# EAGLE design i-oboard 2 (EAGLE 9.6.2)
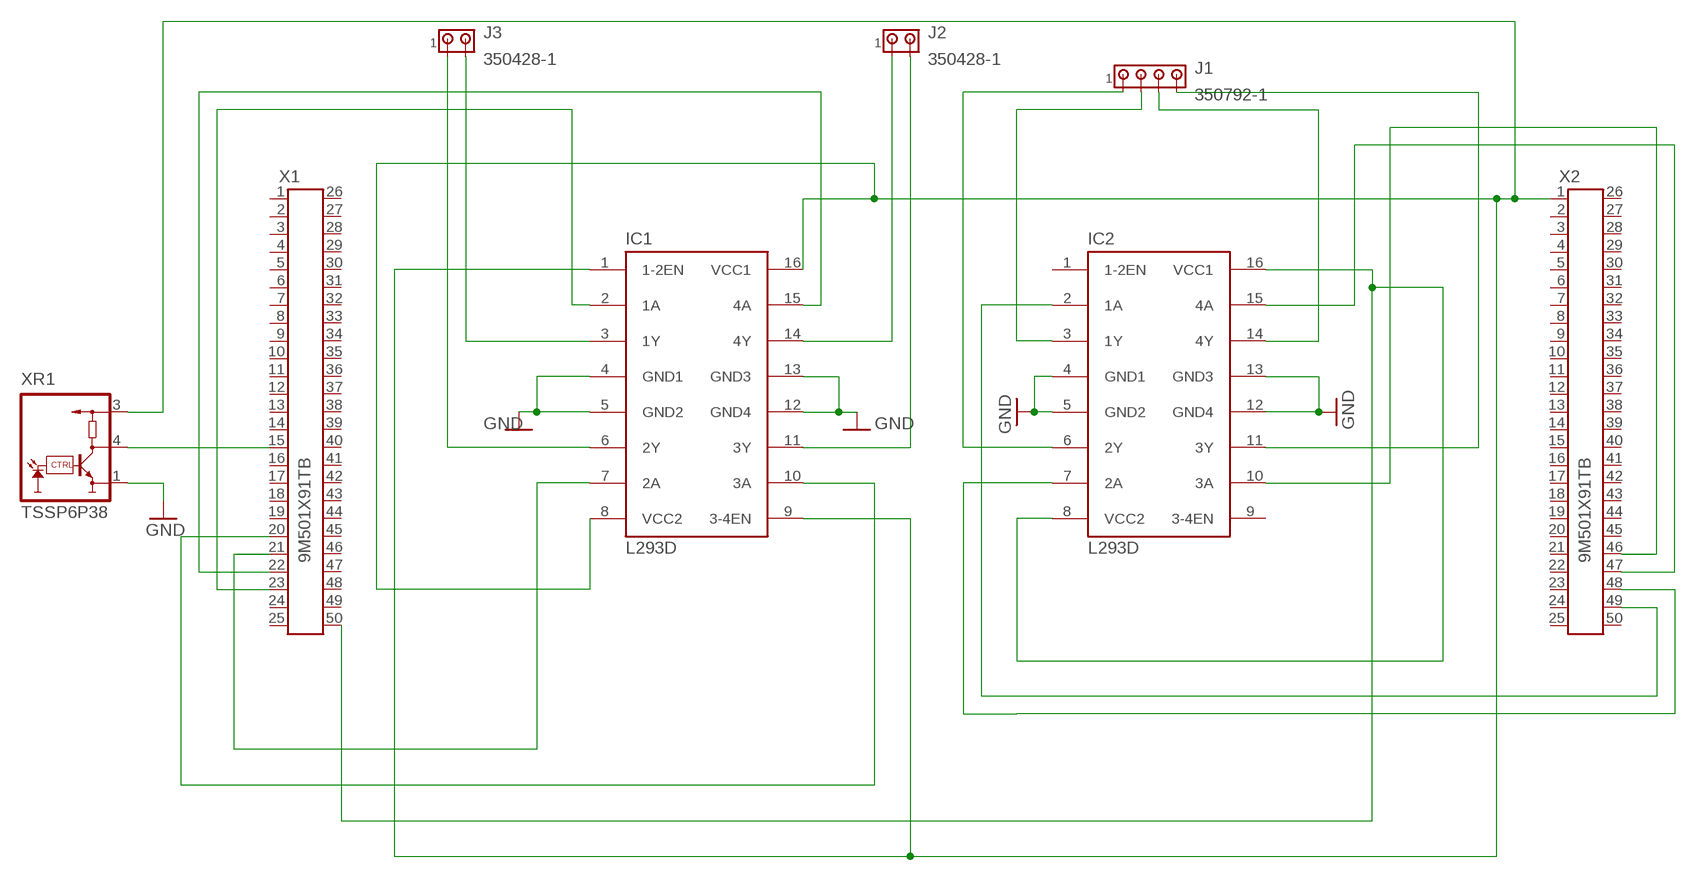
[diagram p0: schematic, sheet 1]

## Parts
IC1  L293D  [DIL16]
IC2  L293D  [DIL16]
J1  350792-1  [350792-1]
J2  350428-1  [350428-1]
J3  350428-1  [350428-1]
X1  9M501X91TB  [9M501X91]
X2  9M501X91TB  [9M501X91]
XR1  TSSP6P38  [TSSP6P38]

## Nets
GND: IC1.4(GND1) IC1.5(GND2) IC1.12(GND4) IC1.13(GND3) IC2.4(GND1) IC2.5(GND2) IC2.12(GND4) IC2.13(GND3) XR1.1(GND)
N$1: IC1.14(4Y) J2.1
N$2: IC1.11(3Y) J2.2
N$3: IC1.3(1Y) J3.2
N$4: IC1.6(2Y) J3.1
N$6: IC2.10(3A) X2.46
N$7: IC2.7(2A) X2.48
N$8: IC2.2(1A) X2.49
N$9: IC2.15(4A) X2.47
N$10: IC2.8(VCC2) IC2.16(VCC1) X1.50
N$12: X1.15 XR1.4(OUT)
N$13: IC2.3(1Y) J1.2
N$14: IC2.6(2Y) J1.1
N$15: IC2.14(4Y) J1.3
N$16: IC2.11(3Y) J1.4
N$17: IC1.2(1A) X1.23
N$18: IC1.15(4A) X1.22
N$19: IC1.7(2A) X1.21
N$20: IC1.10(3A) X1.20
N$21: IC1.1(1-2EN) IC1.8(VCC2) IC1.9(3-4EN) IC1.16(VCC1) X2.1 XR1.3(VS)
Unconnected: IC2.1(1-2EN) IC2.9(3-4EN) X1.1 X1.2 X1.3 X1.4 X1.5 X1.6 X1.7 X1.8 X1.9 X1.10 X1.11 X1.12 X1.13 X1.14 X1.16 X1.17 X1.18 X1.19 X1.24 X1.25 X1.26 X1.27 X1.28 X1.29 X1.30 X1.31 X1.32 X1.33 X1.34 X1.35 X1.36 X1.37 X1.38 X1.39 X1.40 X1.41 X1.42 X1.43 X1.44 X1.45 X1.46 X1.47 X1.48 X1.49 X2.2 X2.3 X2.4 X2.5 X2.6 X2.7 X2.8 X2.9 X2.10 X2.11 X2.12 X2.13 X2.14 X2.15 X2.16 X2.17 X2.18 X2.19 X2.20 X2.21 X2.22 X2.23 X2.24 X2.25 X2.26 X2.27 X2.28 X2.29 X2.30 X2.31 X2.32 X2.33 X2.34 X2.35 X2.36 X2.37 X2.38 X2.39 X2.40 X2.41 X2.42 X2.43 X2.44 X2.45 X2.50

## Library data of the parts
IC1 IC2 = st-microelectronics:L293D: PUSH-PULL 4 CHANNEL DRIVER; MPN: L293D; OC_FARNELL: 9589619; OC_NEWARK: 56P8249
J1 = con-amp:350792-1: Universal MATE-N-LOK .250" Centerline, 600 V, 19 - 36 A max Source: http://catalog.tycoelectronics.com/ .. ENG_CD_350792_R.pdf
J2 J3 = con-amp:350428-1: Universal MATE-N-LOK .250" Centerline, 600 V, 19 - 36 A max Source: http://catalog.tycoelectronics.com/ .. ENG_CD_350428_Y.pdf
X1 X2 = con-3m:9M501X91TB: CONNECTOR PCMCIA-CompactFlash; OC_FARNELL: unknown; OC_NEWARK: unknown
XR1 = opto-vishay:TSSP6P38: IR Mid Range Proximity Sensor Used source: IR Sensor transmitter and receiver diode.pdf Source to corrupt Data sheet <http://www.vishay.com/docs/82475/tssp6p38.pdf>

## Board
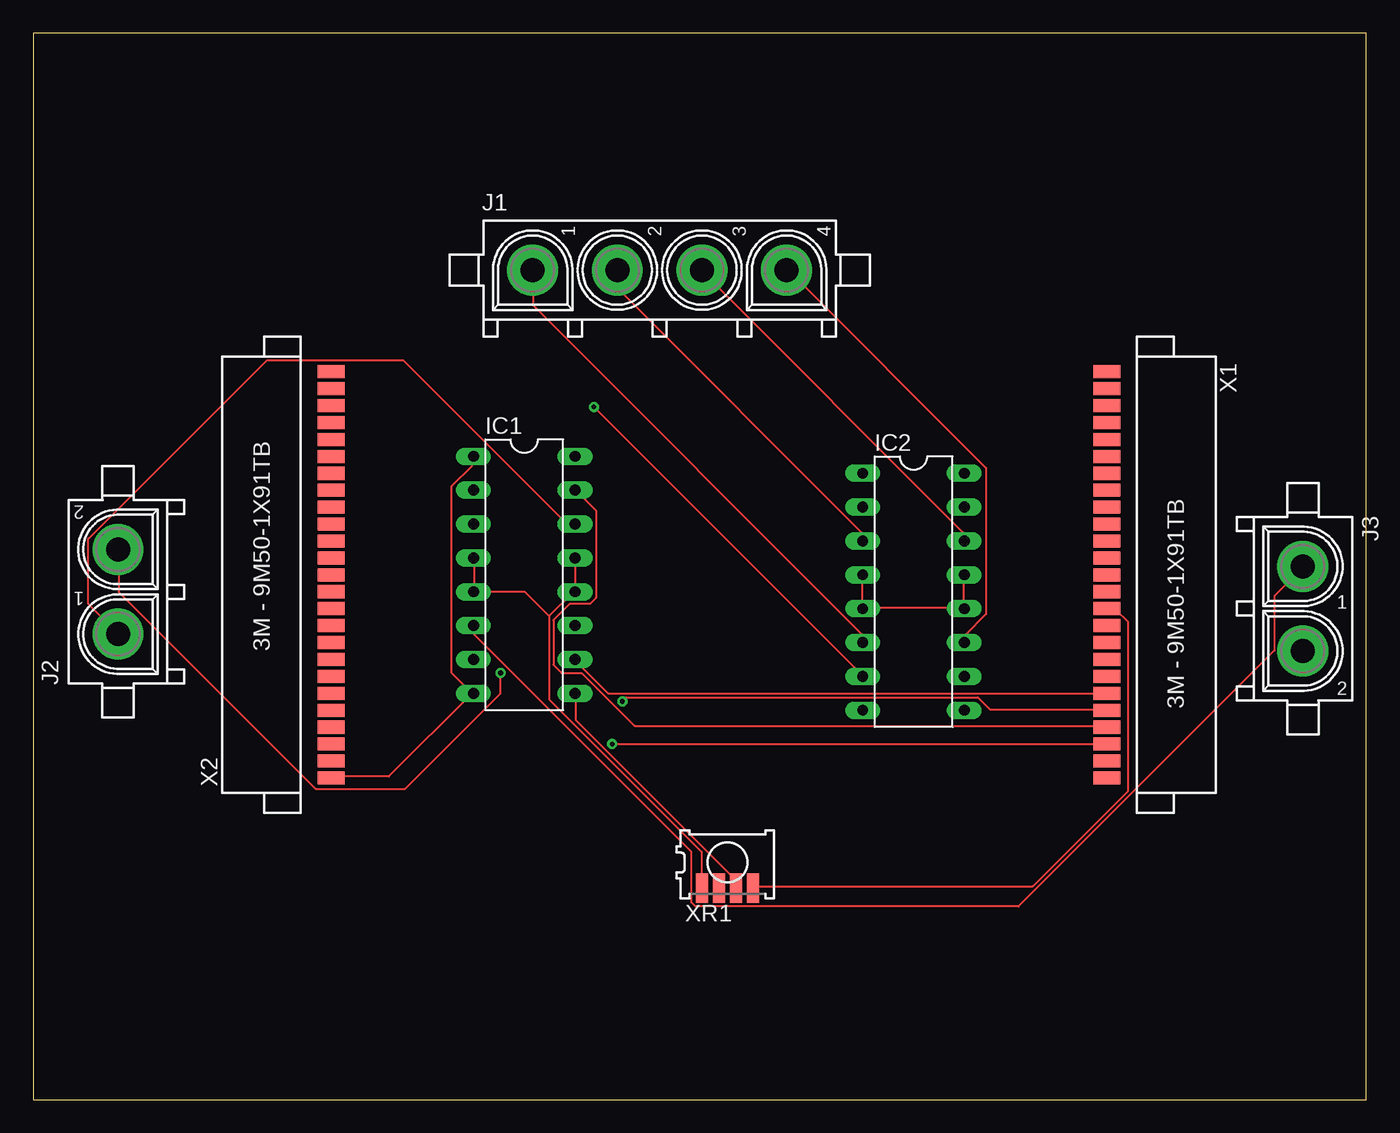
[diagram p1: board, top side]
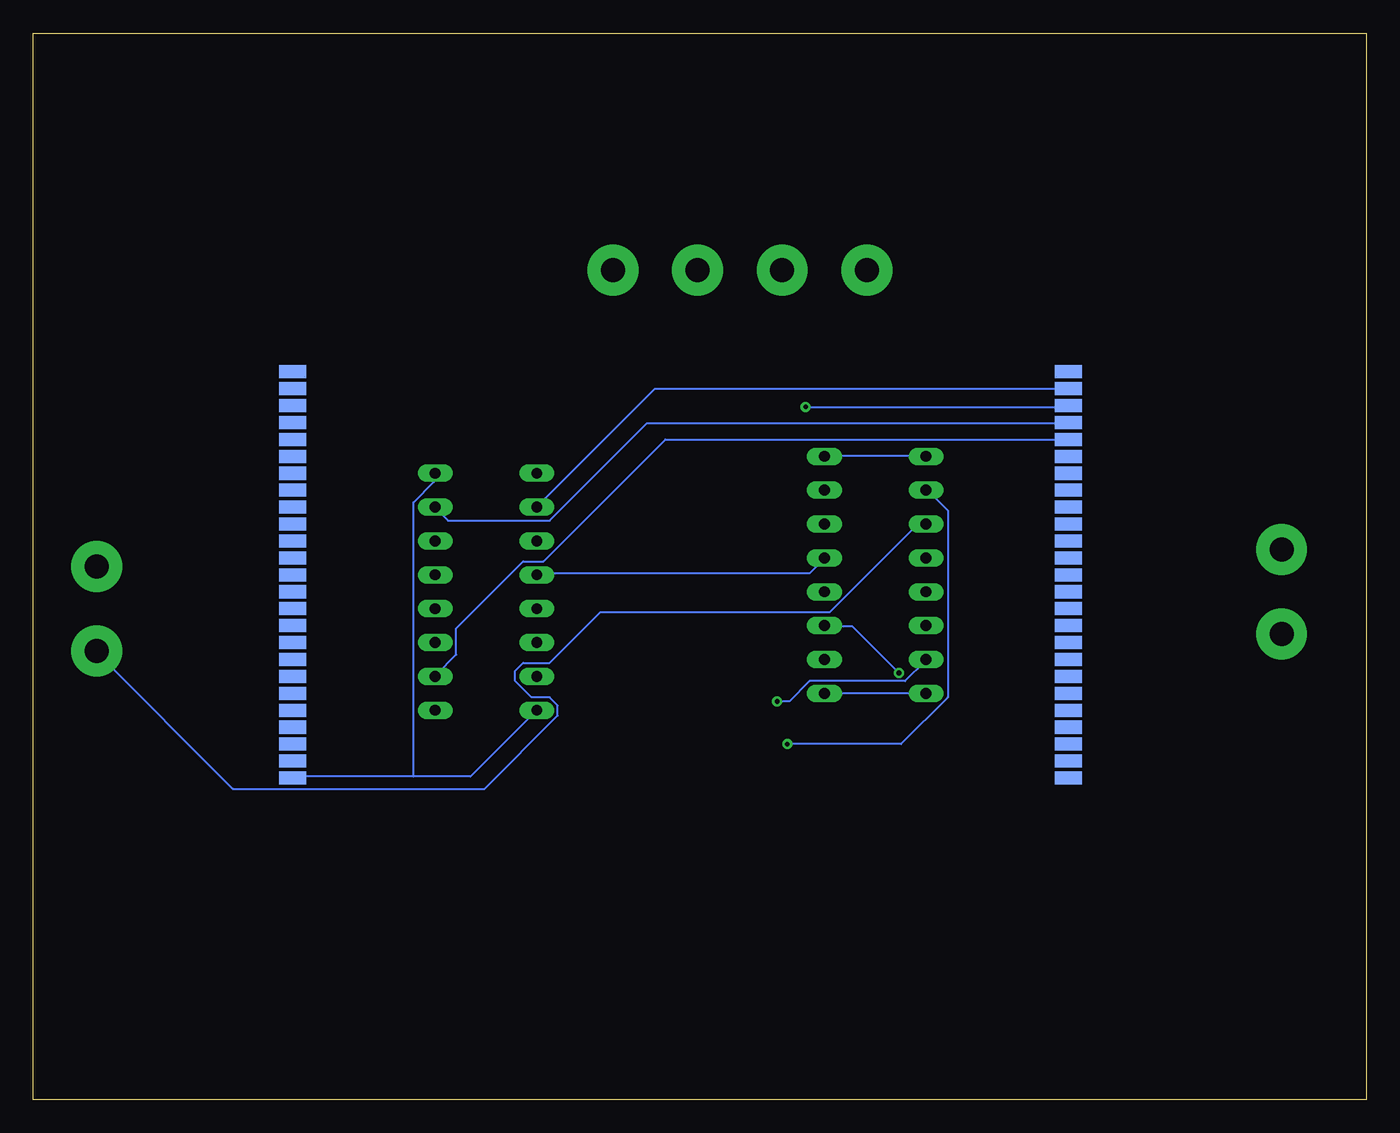
[diagram p2: board, bottom side, seen from below]

Size 100 x 80 mm. Coordinates in mm from the lower left corner, seen from the top.
Outline: 0,0 100,0 100,80 0,80 0,0
Copper layers (1*16): Top 0.035mm / dielectric 1.5mm / Bottom 0.035mm
Design rules "default": minimum track width 6mil, minimum drill 0.35mm, track to track 6mil, track to pad 6mil, pad to pad 6mil, via to via 6mil, smd to smd 6mil, copper to edge 40mil, drill to drill 6mil, minimum pad ring 10mil, minimum via ring 8mil, stop-mask expansion 4mil, vias tented up to drill 0mil, thermal gap 10mil

### Footprints (pad centres in the part's own frame; a part is rotated, then mirrored left to right if it is on the bottom)
DIL16 = drill 0.813 long: 1 -8.89,-3.81; 2 -6.35,-3.81; 3 -3.81,-3.81; 4 -1.27,-3.81; 5 1.27,-3.81; 6 3.81,-3.81; 7 6.35,-3.81; 8 8.89,-3.81; 9 8.89,3.81; 10 6.35,3.81; 11 3.81,3.81; 12 1.27,3.81; 13 -1.27,3.81; 14 -3.81,3.81; 15 -6.35,3.81; 16 -8.89,3.81
350792-1 = drill 1.8 pad 3.81: 1 -9.525,0; 2 -3.175,0; 3 3.175,0; 4 9.525,0
350428-1 = drill 1.8 pad 3.81: 1 -3.175,0; 2 3.175,0
9M501X91 = smd 0.98 x 2.03: 1 -15.24,-3.29; 2 -13.97,-3.29; 3 -12.7,-3.29; 4 -11.43,-3.29; 5 -10.16,-3.29; 6 -8.89,-3.29; 7 -7.62,-3.29; 8 -6.35,-3.29; 9 -5.08,-3.29; 10 -3.81,-3.29; 11 -2.54,-3.29; 12 -1.27,-3.29; 13 0,-3.29; 14 1.27,-3.29; 15 2.54,-3.29; 16 3.81,-3.29; 17 5.08,-3.29; 18 6.35,-3.29; 19 7.62,-3.29; 20 8.89,-3.29; 21 10.16,-3.29; 22 11.43,-3.29; 23 12.7,-3.29; 24 13.97,-3.29; 25 15.24,-3.29 | smd 0.98 x 2.03 bottom: 26 -15.24,-3.29; 27 -13.97,-3.29; 28 -12.7,-3.29; 29 -11.43,-3.29; 30 -10.16,-3.29; 31 -8.89,-3.29; 32 -7.62,-3.29; 33 -6.35,-3.29; 34 -5.08,-3.29; 35 -3.81,-3.29; 36 -2.54,-3.29; 37 -1.27,-3.29; 38 0,-3.29; 39 1.27,-3.29; 40 2.54,-3.29; 41 3.81,-3.29; 42 5.08,-3.29; 43 6.35,-3.29; 44 7.62,-3.29; 45 8.89,-3.29; 46 10.16,-3.29; 47 11.43,-3.29; 48 12.7,-3.29; 49 13.97,-3.29; 50 15.24,-3.29
TSSP6P38 = smd 0.9 x 2.2: 1 -1.905,-1.905; 2 -0.635,-1.905; 3 0.635,-1.905; 4 1.905,-1.905

### Placement (x,y rotation side)
IC1  36.83,39.37 270 top
IC2  66.04,38.1 270 top
J1  46.99,62.23 0 top
J2  6.35,38.1 90 top
J3  95.25,36.83 270 top
X1  83.82,39.37 270 top
X2  19.05,39.37 90 top
XR1  52.07,17.78 0 top

### Tracks (layer width: path | path; a pad name or v marks a point on that pad's centre or on a via)
GND
  Top 0.152: IC2.4 62.18,39.32 62.18,36.88 IC2.5 62.33,36.88 69.8,36.88 | 69.8,36.88 69.8,39.32 IC2.13 | 69.8,36.88 IC2.12 | 33.07,38.1 33.07,40.54 IC1.4 | 38.71,36.27 38.71,30.02 50.14,18.59 50.14,16 XR1.1 | 38.71,36.27 40.54,38.1 IC1.12 40.69,38.1 40.69,40.54 IC1.13 | 33.07,38.1 36.88,38.1 38.71,36.27 | 33.07,38.1 IC1.5
  Bottom 0.152: IC2.4 62.18,39.47 41.76,39.47 40.69,40.54 IC1.13
N$1
  Top 0.152: IC1.14 40.54,43.28 39.93,43.28 27.74,55.47 17.53,55.47 4.12,42.06 4.12,37.19 6.25,35.05 J2.1
N$2  (via drill 0.35)
  Top 0.152: v35.05,32 35.05,30.48 27.89,23.32 21.18,23.32 6.4,38.1 6.4,41.15 J2.2
  Bottom 0.152: v35.05,32 38.56,35.51 40.54,35.51 IC1.11
N$3
  Bottom 0.152: IC1.3 33.07,43.13 33.68,43.13 40.23,36.58 57.45,36.58 61.27,32.77 63.25,32.77 63.86,32.16 63.86,31.39 62.64,30.18 61.27,30.18 60.66,29.57 60.66,28.8 66.14,23.32 85.04,23.32 95.25,33.53 J3.2
N$4
  Top 0.152: IC1.6 33.07,35.51 33.07,34.9 49.38,18.59 49.38,14.78 49.68,14.48 73.91,14.48 93.12,33.68 93.12,37.8 95.25,39.93 J3.1
N$6
  Bottom 0.152: X2.46 52.58,49.53 61.72,40.39 63.25,40.39 68.28,35.36 68.28,33.38 69.8,31.85 IC2.10
N$7  (via drill 0.35)
  Top 0.152: v42.06,51.97 62.18,31.85 IC2.7
  Bottom 0.152: v42.06,51.97 22.4,51.97 X2.48
N$8
  Bottom 0.152: X2.49 53.34,53.34 IC2.2
N$9
  Bottom 0.152: X2.47 22.4,50.75 53.95,50.75 61.27,43.43 68.89,43.43 69.8,44.35 IC2.15
N$10
  Bottom 0.152: 71.48,24.23 67.21,24.23 IC2.8 | 71.48,24.23 80.47,24.23 X1.50 | 71.48,24.23 71.48,44.81 69.95,46.33 69.95,46.94 IC2.16
N$12
  Top 0.152: X1.15 80.62,36.73 81.23,36.73 82.14,35.81 82.14,23.16 74.98,16 54.1,16 XR1.4
N$13
  Top 0.152: IC2.3 62.18,41.91 62.18,42.52 43.89,60.81 43.89,62.18 J1.2
N$14
  Top 0.152: IC2.6 62.18,34.29 62.18,34.9 37.49,59.59 37.49,62.18 J1.1
N$15
  Top 0.152: IC2.14 69.8,41.91 69.8,42.52 50.14,62.18 J1.3
N$16
  Top 0.152: IC2.11 69.95,34.29 69.95,34.9 71.48,36.42 71.48,47.4 56.54,62.33 J1.4
N$17  (via drill 0.35)
  Top 0.152: v43.43,26.67 X1.23
  Bottom 0.152: v43.43,26.67 34.9,26.67 31.39,30.18 31.39,44.2 32.92,45.72 IC1.2
N$18
  Top 0.152: X1.22 80.47,28.04 45.11,28.04 41.15,32 39.62,32 39.01,32.61 39.01,35.97 40.23,37.19 41.76,37.19 42.22,37.64 42.22,44.2 40.69,45.72 IC1.15
N$19  (via drill 0.35)
  Top 0.152: v44.2,29.87 44.5,30.18 70.87,30.18 71.78,29.26 80.47,29.26 X1.21
  Bottom 0.152: v44.2,29.87 43.28,29.87 41.76,31.39 34.59,31.39 33.07,32.92 IC1.7
N$20
  Top 0.152: X1.20 43.13,30.48 40.69,32.92 IC1.10
N$21
  Top 0.152: XR1.3 52.58,16 52.58,16.61 40.69,28.5 40.69,30.48 IC1.9 | 32.92,30.48 26.67,24.23 22.4,24.23 X2.1 | 32.92,30.48 31.39,32 31.39,46.02 32.92,47.55 32.92,48.16 IC1.1 | 32.92,30.48 IC1.8
  Bottom 0.152: IC1.1 33.07,48.31 40.54,48.31 IC1.16 | IC1.8 IC1.9